# EasyEDA schematic SensoCard-Schematic-EasyEDA.json
TITLE: Sheet_1; REV: 1.0; Date: 2021-09-03; Sheet: 1/1; Drawn By: Philipp H; Company: Your Company
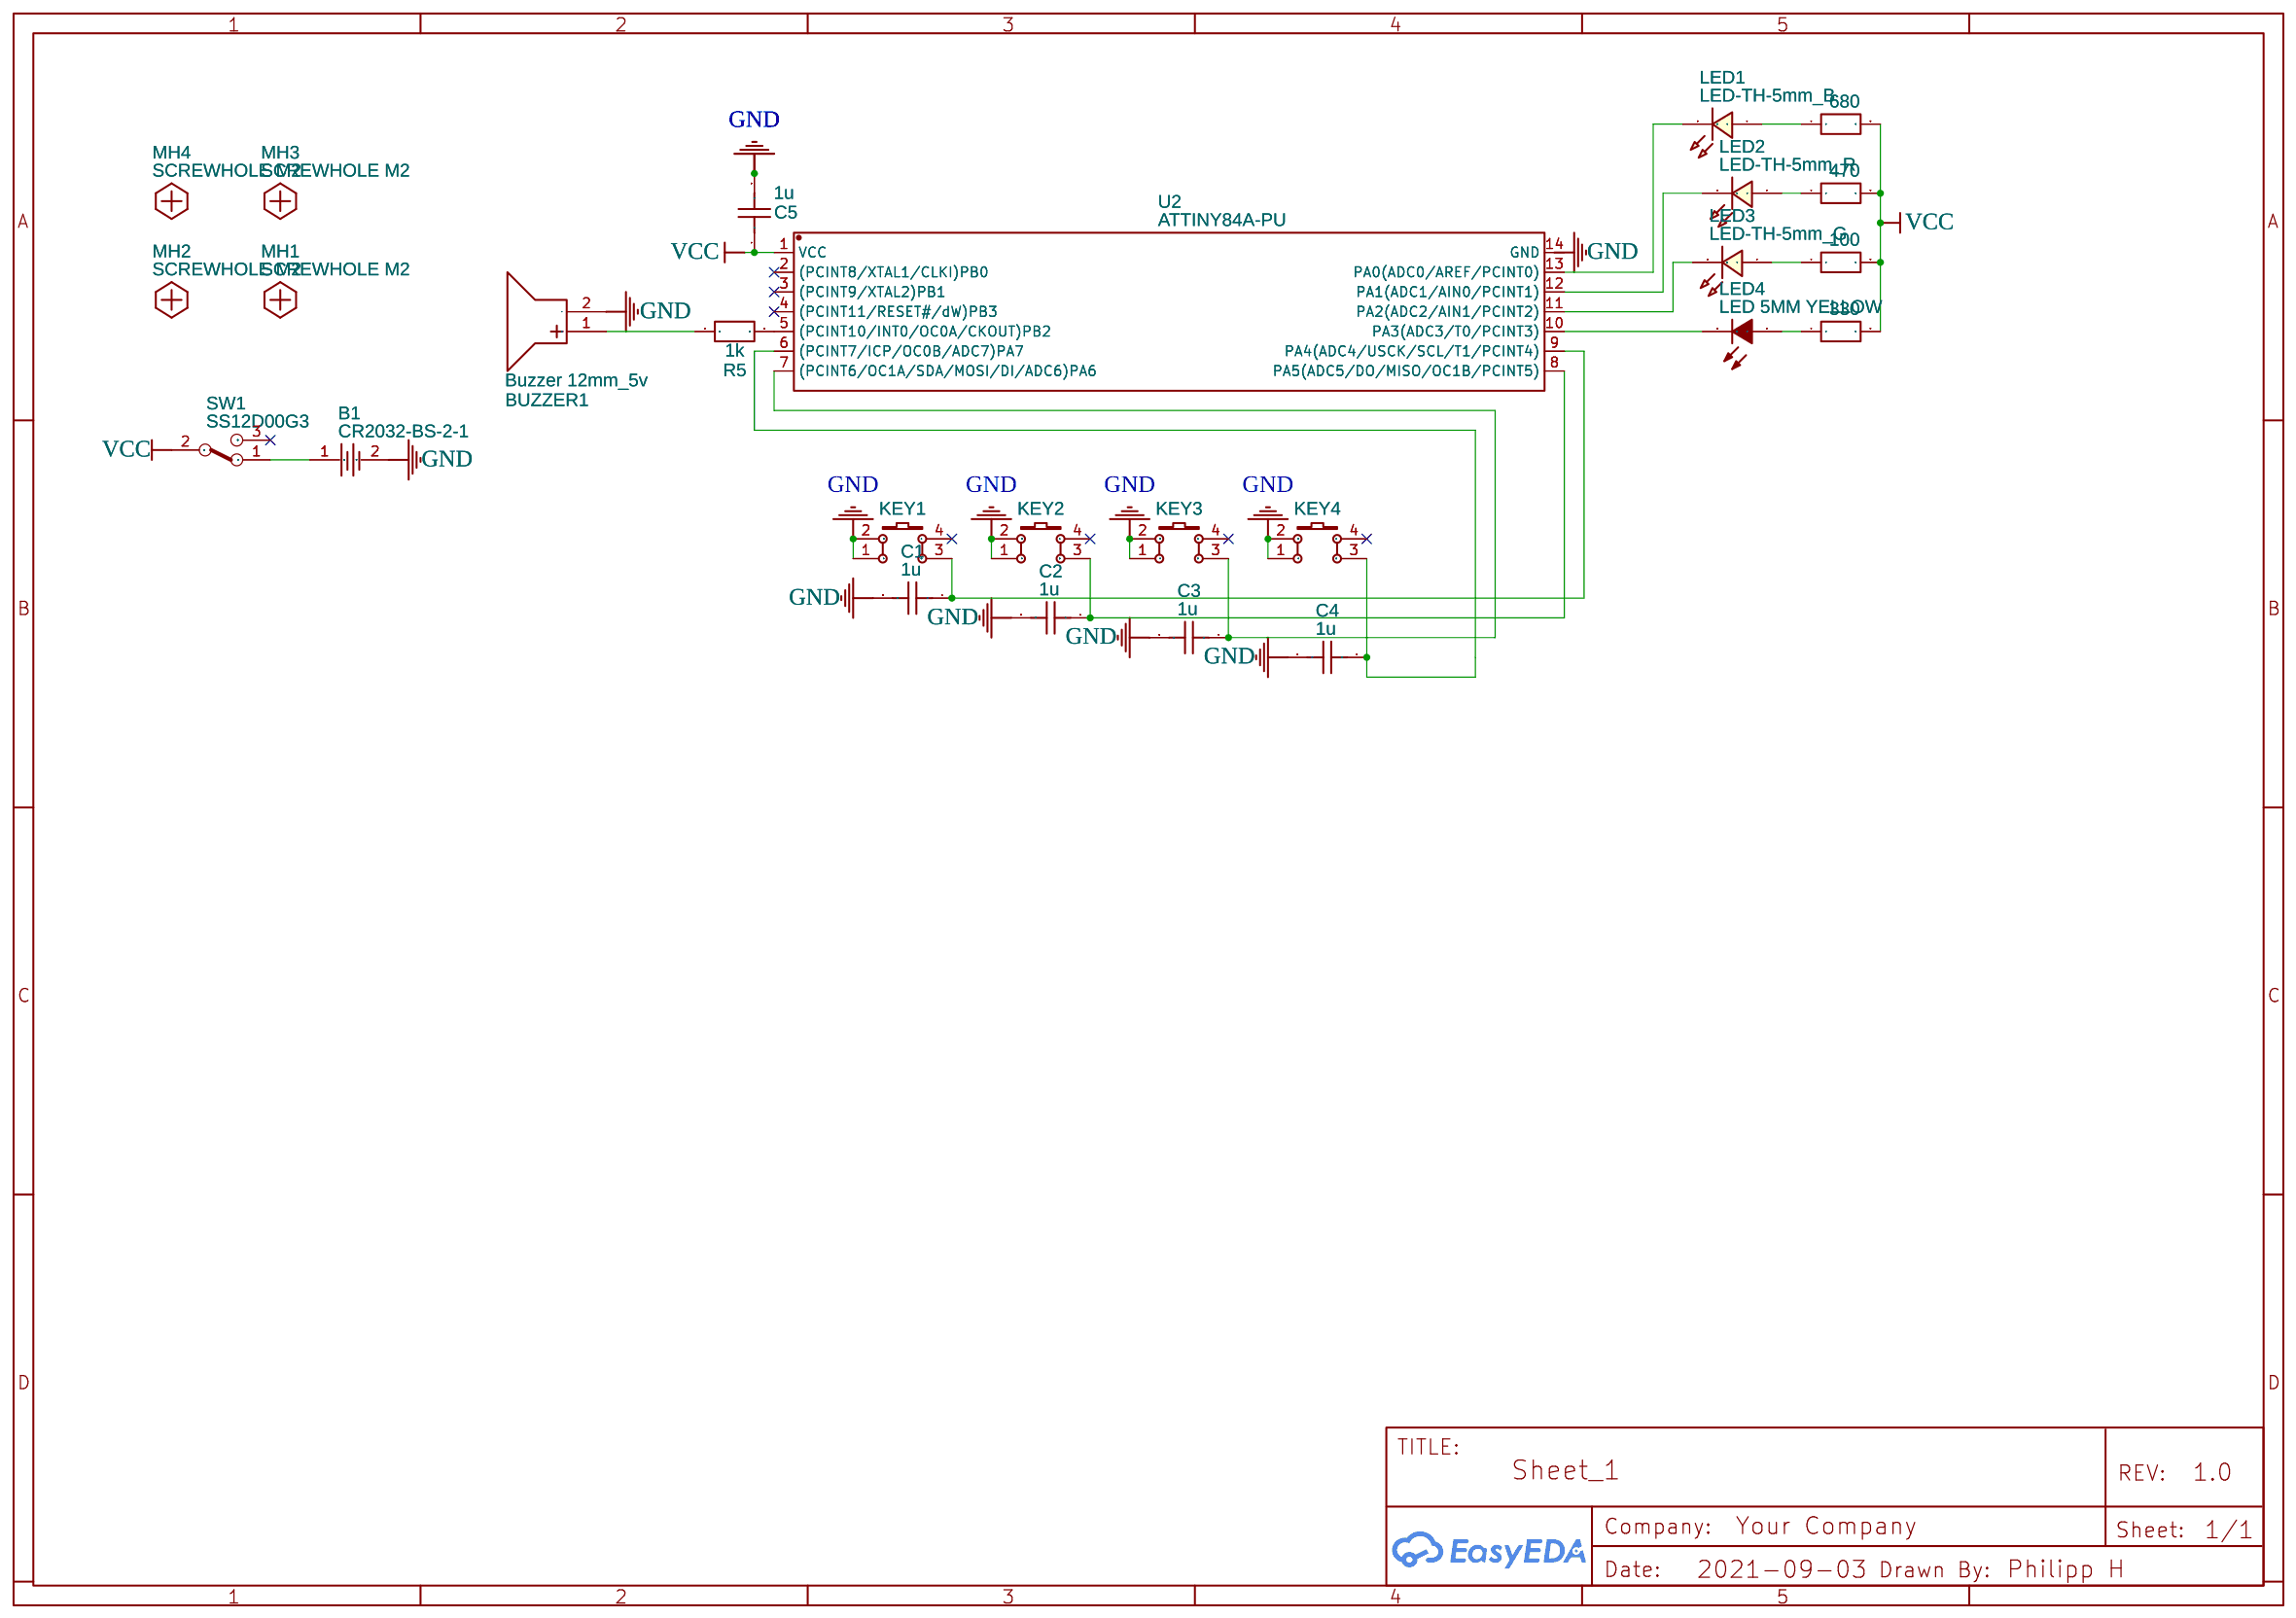
[diagram p0: schematic sheet]

## Parts
B1  CR2032-BS-2-1  [BAT-TH_BS-2-1]
BUZZER1  Buzzer 12mm_5v  [BUZZER-10MM_7MM.0PITCH]
C1  1u  [RAD-0.1]
C2  1u  [RAD-0.1]
C3  1u  [RAD-0.1]
C4  1u  [RAD-0.1]
C5  1u  [RAD-0.1]
KEY1  K4-12×12_TH  [KEY-TH_4P-L12.0-W12.0-P5.00-LS12.5]
KEY2  K4-12×12_TH  [KEY-TH_4P-L12.0-W12.0-P5.00-LS12.5]
KEY3  K4-12×12_TH  [KEY-TH_4P-L12.0-W12.0-P5.00-LS12.5]
KEY4  K4-12×12_TH  [KEY-TH_4P-L12.0-W12.0-P5.00-LS12.5]
LED1  LED-TH-5mm_B  [LED-TH_BD5.0_BLUE]
LED2  LED-TH-5mm_R  [LED-TH_BD5.0_RED]
LED3  LED-TH-5mm_G  [LED-TH_BD5.0_GREEN]
LED4  LED 5MM YELLOW  [LED 5MM YELLOW]
MH1  SCREWHOLE M2  [SCREWHOLE M2]
MH2  SCREWHOLE M2  [SCREWHOLE M2]
MH3  SCREWHOLE M2  [SCREWHOLE M2]
MH4  SCREWHOLE M2  [SCREWHOLE M2]
R1  680  [R_AXIAL-0.3]
R2  470  [R_AXIAL-0.3]
R3  100  [R_AXIAL-0.3]
R4  330  [R_AXIAL-0.3]
R5  1k  [R_AXIAL-0.3]
SW1  SS12D00G3  [SLIDE_MINI_SWITCH]
U2  ATTINY84A-PU  [DIP-14_L19.2-W6.6-P2.54-LS10.9-BL]

## Library data of the parts
B1 = CR2032-BS-2-1: Supplier: LCSC; Manufacturer: Q&J; Manufacturer Part: BS-2-1; image: //image.lceda.cn/szlcsc/C70376.jpg; Supplier Part: C70376
BUZZER1 = Buzzer 12mm_5v: Supplier: LCSC; Supplier Part: C187873; Manufacturer: Dongguan Bolin Elec; Manufacturer Part: BL-PBZ09042C2703YB; Contributor: amocachi
C1-C5 = C_RAD-0.1_US: Contributor: LCEDA_Lib
KEY1-KEY4 = K4-12×12_TH: Supplier Part: C128053; Supplier: LCSC; Manufacturer: 韩国韩荣; Manufacturer Part: K2-1103DP-M4SW-04; Contributor: LCEDA_Lib
LED1 = LED-TH-5mm_B: Supplier: LCSC; Contributor: LCEDA_Lib
LED2 = LED-TH-5mm_R: Manufacturer: EVERLIGHT(台湾亿光); Manufacturer Part: 333-2SURD/S530-A3; Supplier Part: C87271; Supplier: LCSC; Contributor: LCEDA_Lib
LED3 = LED-TH-5mm_G: Manufacturer: EVERLIGHT(台湾亿光); Manufacturer Part: 333-2SYGD/S530-E2; Supplier Part: C88163; Supplier: LCSC; Contributor: LCEDA_Lib
LED4 = LED 5MM YELLOW: Contributor: stephen.mcmxiv
MH1-MH4 = SCREWHOLE M2: Contributor: le0nth3in
R1-R5 = R_AXIAL-0.3_EU: Contributor: LCEDA_Lib
SW1 = SS12D00G3: Manufacturer Part: Switch SPDT; Contributor: hofteboy; Mounted: No
U2 = ATTINY84A-PU: Supplier: LCSC; Manufacturer: MICROCHIP; Contributor: LCSC; Supplier Part: C145560; JLCPCB Part Class: Extended Part

## Nets
GND: B1.2 BUZZER1.2(-) C1.2 C2.2 C3.2 C4.2 C5.2 KEY1.1 KEY1.2 KEY2.1 KEY2.2 KEY3.1 KEY3.2 KEY4.1 KEY4.2 U2.14(GND)
VCC: C5.1 R1.2 R2.2 R3.2 R4.2 SW1.2(NC) U2.1(VCC)
Net-(B1-1): B1.1 SW1.1(C)
Net-(BUZZER1-1): BUZZER1.1(+) R5.1
Net-(C1-1): C1.1 KEY1.3 U2.9(PA4(ADC4/USCK/SCL/T1/PCINT4))
Net-(C2-1): C2.1 KEY2.3 U2.8(PA5(ADC5/DO/MISO/OC1B/PCINT5))
Net-(C3-1): C3.1 KEY3.3 U2.7((PCINT6/OC1A/SDA/MOSI/DI/ADC6)PA6)
Net-(C4-1): C4.1 KEY4.3 U2.6((PCINT7/ICP/OC0B/ADC7)PA7)
Net-(LED1-1): LED1.1 R1.1
Net-(LED1-2): LED1.2 U2.13(PA0(ADC0/AREF/PCINT0))
Net-(LED2-1): LED2.1 R2.1
Net-(LED2-2): LED2.2 U2.12(PA1(ADC1/AIN0/PCINT1))
Net-(LED3-1): LED3.1 R3.1
Net-(LED3-2): LED3.2 U2.11(PA2(ADC2/AIN1/PCINT2))
Net-(LED4-1): LED4.1(A) R4.1
Net-(LED4-2): LED4.2(K) U2.10(PA3(ADC3/T0/PCINT3))
Net-(R5-2): R5.2 U2.5((PCINT10/INT0/OC0A/CKOUT)PB2)

Not connected (* = marked no-connect by the designer): KEY1 4*; KEY2 4*; KEY3 4*; KEY4 4*; SW1 3(NO)*; U2 2((PCINT8/XTAL1/CLKI)PB0)* 3((PCINT9/XTAL2)PB1)* 4((PCINT11/RESET#/dW)PB3)*
